# Altium schematic sheet LKS32MC038Y6P8B+BP85226DF+LKSP1D5007D_V1.0_SCH_20230419.SchDoc
size A3
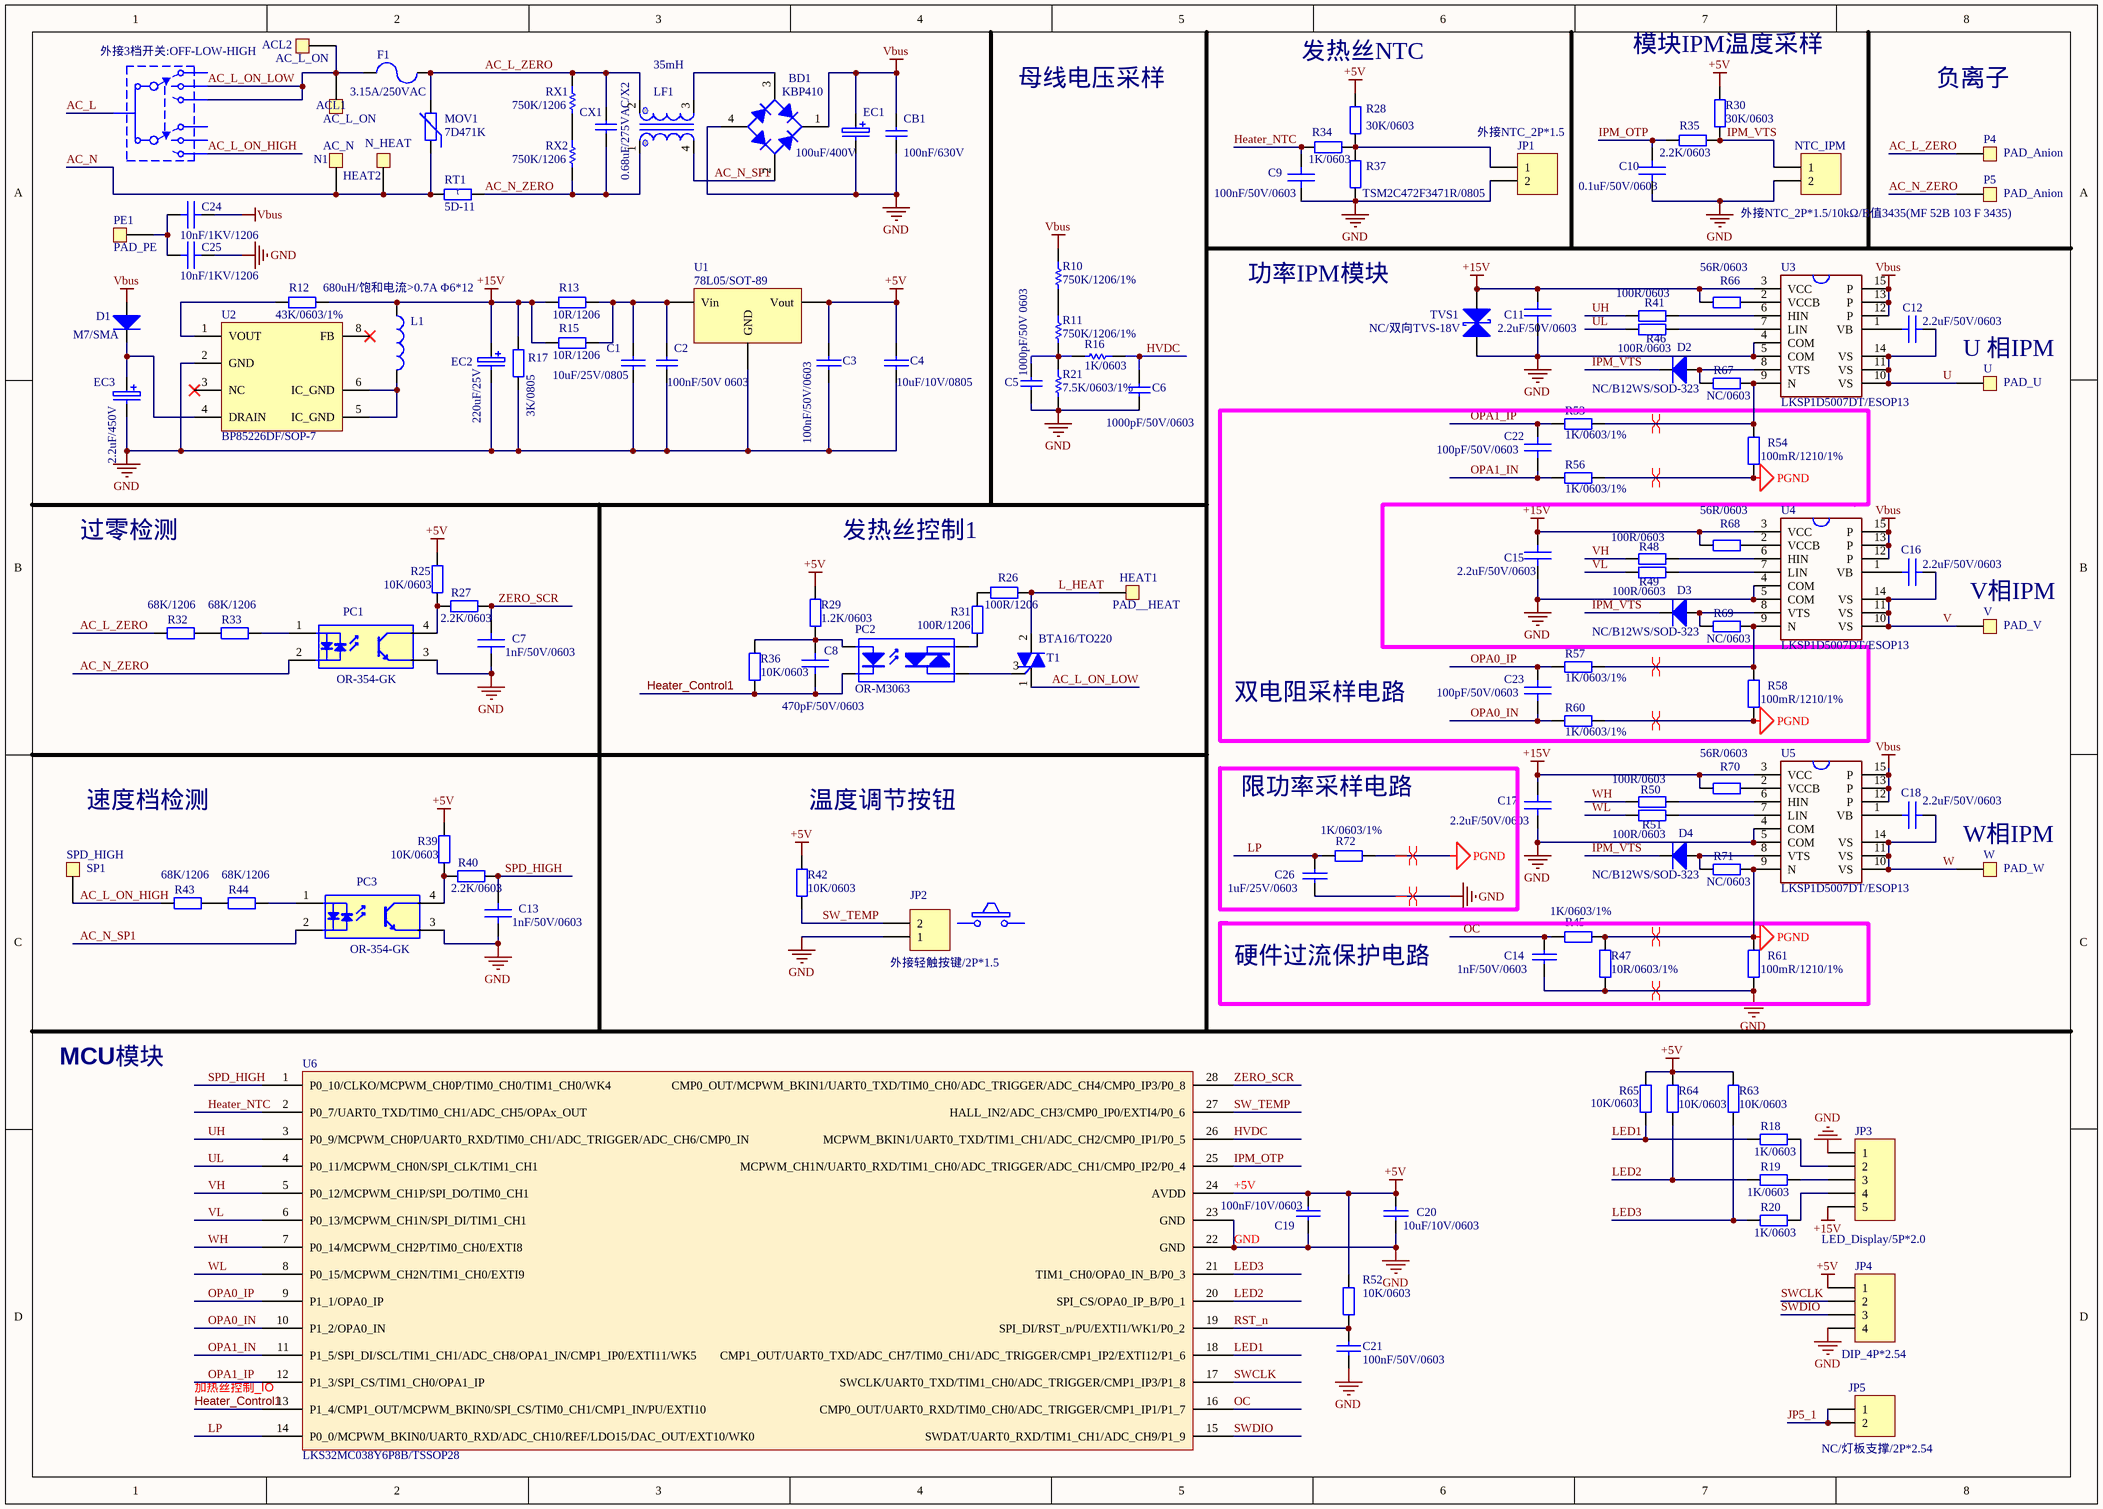
[diagram p0: LKS32MC038Y6P8B+BP85226DF+LKSP1D5007D_V1.0_SCH_20230419.SchDoc]

## Parts
ACL1  AC_L_ON  [22AWG]
ACL2  AC_L_ON  [22AWG]
BD1  KBP410  [KBP210]
C1  10uF/25V/0805  [C0805]
C2  100nF/50V 0603  [C0603]
C3  100nF/50V/0603  [C0603]
C4  10uF/10V/0805  [C0805]
C5  1000pF/50V 0603  [C0603]
C6  1000pF/50V/0603  [C0603]
C7  1nF/50V/0603  [C0603]
C8  470pF/50V/0603  [C0603]
C9  100nF/50V/0603  [C0603]
C10  0.1uF/50V/0603  [C0603]
C11  2.2uF/50V/0603  [C1206]
C12  2.2uF/50V/0603  [C0805]
C13  1nF/50V/0603  [C0603]
C14  1nF/50V/0603  [C0603]
C15  2.2uF/50V/0603  [C1206]
C16  2.2uF/50V/0603  [C0805]
C17  2.2uF/50V/0603  [C1206]
C18  2.2uF/50V/0603  [C0805]
C19  100nF/10V/0603  [C0603]
C20  10uF/10V/0603  [C0603]
C21  100nF/50V/0603  [C0603]
C22  100pF/50V/0603  [C0603]
C23  100pF/50V/0603  [C0603]
C24  10nF/1KV/1206  [C1206]
C25  10nF/1KV/1206  [C1206]
C26  1uF/25V/0603  [C0603]
CB1  100nF/630V  [CY2-7.5]
CX1  0.68uF/275VAC/X2  [0.68uF_X2_L12.8*W7.8*H13.6]
D1  M7/SMA  [SMD-(DO-214AC/SMA)(H)]
D2  NC/B12WS/SOD-323  [SOD-323]
D3  NC/B12WS/SOD-323  [SOD-323]
D4  NC/B12WS/SOD-323  [SOD-323]
EC1  100uF/400V  [E18*32W]
EC2  220uF/25V  [E6.3*7]
EC3  2.2uF/450V  [E6.3*7]
F1  3.15A/250VAC  [FUSE-6528]
HEAT1  PAD__HEAT  [22AWG]
HEAT2  N_HEAT  [22AWG]
JP1  外接NTC_2P*1.5  [XH25-2ADW]
JP2  外接轻触按键/2P*1.5  [XH25-2ADW]
JP3  LED_Display/5P*2.0  [PH20-5AW]
JP4  DIP_4P*2.54  [JP4_P2.54]
JP5  NC/灯板支撑/2P*2.54  [HDR1X2]
L1  680uH/饱和电流>0.7A Φ6*12  [L3.0]
LF1  35mH  [L17MM]
MOV1  7D471K  [07D561]
N1  AC_N  [22AWG]
NTC_IPM  外接NTC_2P*1.5/10kΩ/B值3435(MF 52B 103 F 3435)  [HDR1X2]
P4  PAD_Anion  [22AWG]
P5  PAD_Anion  [22AWG]
PC1  OR-354-GK  [CTM3053+EL3H4-G]
PC2  OR-M3063  [CTM3053]
PC3  OR-354-GK  [CTM3053+EL3H4-G]
PE1  PAD_PE  [22AWG]
R10  750K/1206/1%  [R1206]
R11  750K/1206/1%  [R1206]
R12  43K/0603/1%  [R0603]
R13  10R/1206  [R1206]
R15  10R/1206  [R1206]
R16  1K/0603  [R0603]
R17  3K/0805  [R0805]
R18  1K/0603  [R0603]
R19  1K/0603  [R0603]
R20  1K/0603  [R0603]
R21  7.5K/0603/1%  [R0603]
R25  10K/0603  [R0603]
R26  100R/1206  [R1206]
R27  2.2K/0603  [R0603]
R28  30K/0603  [R0603]
R29  1.2K/0603  [R0603]
R30  30K/0603  [R0603]
R31  100R/1206  [R1206]
R32  68K/1206  [R1206]
R33  68K/1206  [R1206]
R34  1K/0603  [R0603]
R35  2.2K/0603  [R0603]
R36  10K/0603  [R0603]
R37  TSM2C472F3471R/0805  [R0805]
R39  10K/0603  [R0603]
R40  2.2K/0603  [R0603]
R41  100R/0603  [R0603]
R42  10K/0603  [R0603]
R43  68K/1206  [R1206]
R44  68K/1206  [R1206]
R45  1K/0603/1%  [R0603]
R46  100R/0603  [R0603]
R47  10R/0603/1%  [R0603]
R48  100R/0603  [R0603]
R49  100R/0603  [R0603]
R50  100R/0603  [R0603]
R51  100R/0603  [R0603]
R52  10K/0603  [R0603]
R53  value 1K/0603/1%  [R0603]  (hidden comment: 1K 1%)
R54  100mR/1210/1%  [R1206]
R56  value 1K/0603/1%  [R0603]  (hidden comment: 1K 1%)
R57  value 1K/0603/1%  [R0603]  (hidden comment: 1K 1%)
R58  100mR/1210/1%  [R1206]
R60  value 1K/0603/1%  [R0603]  (hidden comment: 1K 1%)
R61  100mR/1210/1%  [R1206]
R63  10K/0603  [R0603]
R64  10K/0603  [R0603]
R65  10K/0603  [R0603]
R66  56R/0603  [R0603]
R67  NC/0603  [R0603]
R68  56R/0603  [R0603]
R69  NC/0603  [R0603]
R70  56R/0603  [R0603]
R71  NC/0603  [R0603]
R72  1K/0603/1%  [R0603]
RT1  5D-11  [07D561]
RX1  750K/1206  [R1206]
RX2  750K/1206  [R1206]
SP1  SPD_HIGH  [22AWG]
T1  BTA16/TO220  [TO-220-2A]
TVS1  NC/双向TVS-18V  [SMD-(DO-214AC/SMA)(H)]
U  PAD_U  [22AWG]
U1  78L05/SOT-89  [SOT-89]
U2  BP85226DF/SOP-7  [SO-8]
U3  LKSP1D5007DT/ESOP13  [LKSP1D5007D-ESOP13]
U4  LKSP1D5007DT/ESOP13  [LKSP1D5007D-ESOP13]
U5  LKSP1D5007DT/ESOP13  [LKSP1D5007D-ESOP13]
U6  LKS32MC038Y6P8B/TSSOP28  [TSSOP28]
V  PAD_V  [22AWG]
W  PAD_W  [22AWG]

## Blocks framed on the sheet
双电阻采样电路: C22 C23 R53 R54 R56-R58 R60
限功率采样电路: C26 R72

## Nets
+5V: C3.2 C4.2 C19.2 C20.2 JP4.1 R25.2 R28.2 R29.2 R30.1 R39.2 R42.1 R52.1 R63.1 R64.1 R65.1 U1.1(Vout) U6.24(AVDD)
+15V: C11.1 C15.1 C17.1 EC2.1(+) JP3.5 L1.1 R12.1 R13.2 R15.2 R17.1 R66.1 R68.1 R70.1 TVS1.2(K) U3.3(VCC) U4.3(VCC) U5.3(VCC)
GND: BD1.4(A) C1.1 C2.2 C3.1 C4.1 C5.1 C6.1 C7.1 C9.1 C10.1 C11.2 C13.1 C14.1 C15.2 C17.2 C19.1 C20.1 C21.2 C25.2 C26.1 CB1.1 EC1.2(-) EC2.2(-) EC3.2(-) JP1.2 JP2.1 JP3.1 JP4.4 NTC_IPM.2 PC1.3 PC3.3 R17.2 R21.1 R37.2 R47.1 R61.1 TVS1.1(A) U1.2(GND) U2.2(GND) U3.4(COM) U3.5(COM) U4.4(COM) U4.5(COM) U5.4(COM) U5.5(COM) U6.22(GND) U6.23(GND)
PGND: R45.1 R47.2 R54.1 R56.1 R58.1 R60.1 R61.2 R71.1 R72.1 U5.9(N)
Vbus: BD1.1(K) C24.2 CB1.2 D1.1 EC1.1(+) R10.2 U3.12(P) U3.13(P) U3.15(P) U4.12(P) U4.13(P) U4.15(P) U5.12(P) U5.13(P) U5.15(P)
AC_L_ON_HIGH: R43.1 SP1.1
AC_L_ON_LOW: ACL1.1 ACL2.1 F1.1 T1.1
AC_L_ZERO: CX1.2 F1.2 LF1.2 MOV1.2 P4.1 R32.1 RX1.2
AC_N: HEAT2.1 MOV1.1 N1.1 RT1.1
AC_N_SP1: BD1.2(C) LF1.4 PC3.2
AC_N_ZERO: CX1.1 LF1.1 P5.1 PC1.2 RT1.2 RX2.1
Heater_Control1: C8.2 PC2.2(K) R36.1 U6.13(P1_4/CMP1_OUT/MCPWM_BKIN0/SPI_CS/TIM0_CH1/CMP1_IN/PU/EXTI10)
Heater_NTC: C9.2 R34.2 U6.2(P0_7/UART0_TXD/TIM0_CH1/ADC_CH5/OPAx_OUT)
HVDC: C6.2 R16.2 U6.26(MCPWM_BKIN1/UART0_TXD/TIM1_CH1/ADC_CH2/CMP0_IP1/P0_5)
IPM_OTP: C10.2 R35.2 U6.25(MCPWM_CH1N/UART0_RXD/TIM1_CH0/ADC_TRIGGER/ADC_CH1/CMP0_IP2/P0_4)
IPM_VTS: D2.2 D3.2 D4.2 NTC_IPM.1 R30.2 R35.1
JP5_1: JP5.1 JP5.2
L_HEAT: HEAT1.1 R26.2 T1.2
LED1: R18.2 R65.2 U6.18(CMP1_OUT/UART0_TXD/ADC_CH7/TIM0_CH1/ADC_TRIGGER/CMP1_IP2/EXTI12/P1_6)
LED2: R19.2 R64.2 U6.20(SPI_CS/OPA0_IP_B/P0_1)
LED3: R20.2 R63.2 U6.21(TIM1_CH0/OPA0_IN_B/P0_3)
LP: C26.2 R72.2 U6.14(P0_0/MCPWM_BKIN0/UART0_RXD/ADC_CH10/REF/LDO15/DAC_OUT/EXT10/WK0)
OC: C14.2 R45.2 U6.16(CMP0_OUT/UART0_RXD/TIM0_CH0/ADC_TRIGGER/CMP1_IP1/P1_7)
OPA0_IN: C23.2 R60.2 U6.10(P1_2/OPA0_IN)
OPA0_IP: C23.1 R57.2 U6.9(P1_1/OPA0_IP)
OPA1_IN: C22.2 R56.2 U6.11(P1_5/SPI_DI/SCL/TIM1_CH1/ADC_CH8/OPA1_IN/CMP1_IP0/EXTI11/WK5)
OPA1_IP: C22.1 R53.2 U6.12(P1_3/SPI_CS/TIM1_CH0/OPA1_IP)
RST_n: C21.1 R52.2 U6.19(SPI_DI/RST_n/PU/EXTI1/WK1/P0_2)
SPD_HIGH: C13.2 R40.2 U6.1(P0_10/CLKO/MCPWM_CH0P/TIM0_CH0/TIM1_CH0/WK4)
SW_TEMP: JP2.2 R42.2 U6.27(HALL_IN2/ADC_CH3/CMP0_IP0/EXTI4/P0_6)
SWCLK: JP4.2 U6.17(SWCLK/UART0_TXD/TIM1_CH0/ADC_TRIGGER/CMP1_IP3/P1_8)
SWDIO: JP4.3 U6.15(SWDAT/UART0_RXD/TIM1_CH1/ADC_CH9/P1_9)
U: C12.2 U.1 U3.10(VS) U3.11(VS) U3.14(VS)
UH: R41.1 U6.3(P0_9/MCPWM_CH0P/UART0_RXD/TIM0_CH1/ADC_TRIGGER/ADC_CH6/CMP0_IN)
UL: R46.1 U6.4(P0_11/MCPWM_CH0N/SPI_CLK/TIM1_CH1)
V: C16.2 U4.10(VS) U4.11(VS) U4.14(VS) V.1
VH: R48.1 U6.5(P0_12/MCPWM_CH1P/SPI_DO/TIM0_CH1)
VL: R49.1 U6.6(P0_13/MCPWM_CH1N/SPI_DI/TIM1_CH1)
W: C18.2 U5.10(VS) U5.11(VS) U5.14(VS) W.1
WH: R50.1 U6.7(P0_14/MCPWM_CH2P/TIM0_CH0/EXTI8)
WL: R51.1 U6.8(P0_15/MCPWM_CH2N/TIM1_CH0/EXTI9)
ZERO_SCR: C7.2 R27.2 U6.28(CMP0_OUT/MCPWM_BKIN1/UART0_TXD/TIM0_CH0/ADC_TRIGGER/ADC_CH4/CMP0_IP3/P0_8)
NetBD1_3: BD1.3(C) LF1.3
NetC1_2: C1.2 C2.1 R13.1 R15.1 U1.3(Vin)
NetC5_2: C5.2 R11.1 R16.1 R21.2
NetC8_1: C8.1 PC2.1(A) R29.1 R36.2
NetC12_1: C12.1 U3.1(VB)
NetC16_1: C16.1 U4.1(VB)
NetC18_1: C18.1 U5.1(VB)
NetC24_1: C24.1 C25.1 PE1.1
NetD1_2: D1.2 EC3.1(+) U2.4(DRAIN)
NetD2_1: D2.1 R67.2 U3.8(VTS)
NetD3_1: D3.1 R69.2 U4.8(VTS)
NetD4_1: D4.1 R71.2 U5.8(VTS)
NetJP1_1: JP1.1 R28.1 R34.1 R37.1
NetJP3_2: JP3.2 R18.1
NetJP3_3: JP3.3 R19.1
NetJP3_4: JP3.4 R20.1
NetL1_2: L1.2 U2.5(IC_GND) U2.6(IC_GND)
NetPC1_1: PC1.1 R33.2
NetPC1_4: PC1.4 R25.1 R27.1
NetPC2_3: PC2.3(A/K) T1.3
NetPC2_4: PC2.4(A/K) R31.1
NetPC3_1: PC3.1 R44.2
NetPC3_4: PC3.4 R39.1 R40.1
NetR10_1: R10.1 R11.2
NetR12_2: R12.2 U2.1(VOUT)
NetR26_1: R26.1 R31.2
NetR32_2: R32.2 R33.1
NetR41_2: R41.2 U3.6(HIN)
NetR43_2: R43.2 R44.1
NetR46_2: R46.2 U3.7(LIN)
NetR48_2: R48.2 U4.6(HIN)
NetR49_2: R49.2 U4.7(LIN)
NetR50_2: R50.2 U5.6(HIN)
NetR51_2: R51.2 U5.7(LIN)
NetR53_1: R53.1 R54.2 R67.1 U3.9(N)
NetR57_1: R57.1 R58.2 R69.1 U4.9(N)
NetR66_2: R66.2 U3.2(VCCB)
NetR68_2: R68.2 U4.2(VCCB)
NetR70_2: R70.2 U5.2(VCCB)
NetRX1_1: RX1.1 RX2.2

Not connected (* = marked no-connect by the designer): U2 3(NC)* 8(FB)*

## Layout directives
differential pair: GND, NetR53_1, NetR57_1, PGND

## Notes on the sheet
- 外接3档开关:OFF-LOW-HIGH
- 母线电压采样
- (near R28) 发热丝NTC
- (near R30) 模块IPM温度采样
- 功率IPM模块
- (near U) U 相IPM
- 过零检测
- 发热丝控制1
- (near V) V相IPM
- 速度档检测
- 温度调节按钮
- (near W) W相IPM
- 硬件过流保护电路
- MCU模块
- 加热丝控制_IO
- Labels drawn without touching a wire or pin: 负离子
- (in symbol RT-10D) t

## Library data of the parts
ACL1 ACL2 HEAT1 HEAT2 N1 P4 P5 PE1 SP1 U V W = Header-1-PE
BD1 = BD
C1 C3 C4 C14 C19-C21 C26 = C: Capacitor
C2 C5 C6 = C-0603
C7 C9 C10 C13 = C-0603-104K50-X7R: CODE: C-0603-104K50-X7R
C8 = C-0603-471K50-X7R: C-0603; CODE: C-0603-102K50-X7R
C11 C15 C17 C22-C25 = C-0805-475K50-X7R: 0805; CODE: C-0805-475K50-X7R
C12 C16 C18 = C-0805-225K50-X7R: C-0805; MPN1: CC0805KKX7R9BB225; NAME: 贴片电容; SPEC: 2.2uF,50V,±10%, X7R; TYPE: SMD; VENDOR1: 国巨; VENDOR2: 华新科; PRICE: *; MPN2: 0805B225K500CT
CB1 = CBB-12*6-P10
CX1 = CX-18*8.5-P15
D1-D4 = D-1N4148W: SOD-123; CODE: DN-1N4148W-SOD123
EC1 = CD
EC2 EC3 = CD-8
F1 = FUSE-3.6*10
JP1 JP2 JP5 NTC_IPM = Header 2: Header, 2-Pin; LatestRevisionDate: 17-Jul-2002; LatestRevisionNote: Re-released for DXP Platform.; Publisher: Altium Limited
JP3 = Header 5: Header, 5-Pin; LatestRevisionDate: 17-Jul-2002; LatestRevisionNote: Re-released for DXP Platform.; Publisher: Altium Limited
JP4 = Header 4: Header, 4-Pin; LatestRevisionDate: 17-Jul-2002; LatestRevisionNote: Re-released for DXP Platform.; Publisher: Altium Limited
L1 = L-Φ10
LF1 = L--CM
MOV1 = RV-10D: 压敏
PC1 PC3 = EL3H4
PC2 = PC-TLP265J: SOP-4; SPEC: -40 to 100 ℃,IF 20mA,VDRM 600V,VF 1.27V; NAME: 光耦; VENDOR1: TOSHIBA; PRICE: *; TYPE: SMD; CODE: *; MPN1: TLP265J
R10 R11 R21 RX1 RX2 = R-1206
R12 R13 R15 R45 R52 R53 R56 R57 R60 R63-R65 R72 = Res2: Resistor; Published: 8-Jun-2000; LatestRevisionDate: 17-Jul-2002; LatestRevisionNote: Re-released for DXP Platform.; Publisher: Altium Limited
  R12 R13 R15 R45 R52 R63-R65 R72: PackageReference: 0603R
  R53 R56 R57 R60: PackageReference: AXIAL-0.4; PackageDescription: Axial Device, Thru-Hole; 2 Leads; 0.4 in Pin Spacing
R16 = R-0603
R17 R37 = R-0805-0R--J: 0805 resistor; CODE: R-0805-0-J
R18-R20 = R-1206-200K-F: R-1206; CODE: R-1206-471--F
R25 R32 R33 R39 R42-R44 = Res2: Resistor; Value: 10K; Published: 8-Jun-2000; LatestRevisionDate: 17-Jul-2002; LatestRevisionNote: Re-released for DXP Platform.; PackageReference: AXIAL-0.4; Publisher: Altium Limited
R26 R31 = R-1206-270--F: 1206 resistor; CODE: R-1206-271--J
R27 R40 = R-0603-2.2K-F: R-0603; code: R-0603-202-F
R28 R34 = R-0603-10K-J: 0603 resistor; code: R-0603-103-J
R29 R36 = R-0603-100--J: 0603 resistor; code: R-0603-100-F
R30 R35 = R-0603-5.1K-F: 0603 resistor; code: R-0603-512-F
R41 R46 R48-R51 R66-R71 = R-0805-3.6K--F: R-0805; MPN1: RC0805FR-073K6L; VENDOR2: 风华; SPEC: 3.6K,±1%,1/8W; VENDOR1: 国巨; NAME: 贴片电阻; PRICE: *; TYPE: SMD; MPN2: RS-05K3601FT
R47 = R-1206-10R-F: R-1206; MPN1: RC1206FR-0710RL; VENDOR1: 国巨; SPEC: 10R,±1%,1/4W; NAME: 贴片电阻; VENDOR2: 风华; PRICE: *; MPN2: RS-06K10R0FT; TYPE: SMD
R54 R58 R61 = R-1206-1R-F: R-1206; MPN1: RC1206FR-071RL; VENDOR1: 国巨; SPEC: 1R,±1%,1/4W; NAME: 贴片电阻; VENDOR2: 风华; PRICE: *; MPN2: RS-06L1R00FT; TYPE: SMD
RT1 = RT-10D: 热敏
T1 = T-BTA16: TO-220; MPN1: T1635T-8FP; NAME: 可控硅; SPEC: 600V，16A，绝缘，Igt 35mA; TYPE: MI; VENDOR1: ST; CODE: *; PRICE: *
TVS1 = ESD-ESDA0603 -LC: ESD-0603; NAME: 高分子ESD; SPEC: 18V,1PF,＜0.5ns,8KV; VENDOR1: 华颖; MPN1: ESDA0603 -LC; TYPE: SMD; PRICE: *
U1 = VOL-78
U2 = BP85256D
U3-U5 = BP1N4005D: Gate Driver
U6 = LKS32MC038Y6P8B: TSSOP28